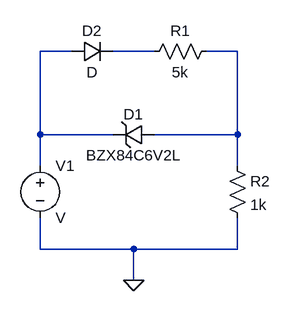
[diagram p0: schematic Experiment 2.asc]
Experiment 2.asc, the LTspice schematic file:
Version 4
SHEET 1 880 680
WIRE -48 -48 -96 -48
WIRE 80 -48 16 -48
WIRE 208 -48 160 -48
WIRE -96 80 -96 -48
WIRE 16 80 -96 80
WIRE 208 80 208 -48
WIRE 208 80 80 80
WIRE -96 128 -96 80
WIRE 208 128 208 80
WIRE -96 256 -96 208
WIRE 48 256 -96 256
WIRE 208 256 208 208
WIRE 208 256 48 256
WIRE 48 304 48 256
FLAG 48 304 0
SYMBOL voltage -96 112 R0
SYMATTR InstName V1
SYMBOL zener 80 64 R90
WINDOW 0 0 32 VBottom 2
WINDOW 3 32 32 VTop 2
SYMATTR InstName D1
SYMATTR Value BZX84C6V2L
SYMATTR Description Diode
SYMATTR Type diode
SYMBOL diode -48 -32 R270
WINDOW 0 32 32 VTop 2
WINDOW 3 0 32 VBottom 2
SYMATTR InstName D2
SYMBOL res 176 -64 R90
WINDOW 0 0 56 VBottom 2
WINDOW 3 32 56 VTop 2
SYMATTR InstName R1
SYMATTR Value 5k
SYMBOL res 192 112 R0
SYMATTR InstName R2
SYMATTR Value 1k

The netlist it stands for:
* Experiment 2.asc
V1 N001 0 V
D1 N003 N001 BZX84C6V2L
D2 N001 N002 D
R1 N003 N002 5k
R2 N003 0 1k
.model D D
.lib standard.dio
.backanno
.end